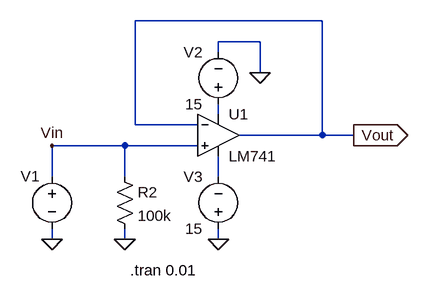
[diagram p0: schematic lab5_1.asc]
lab5_1.asc, the LTspice schematic file:
Version 4
SHEET 1 880 680
WIRE 336 0 48 0
WIRE 240 32 176 32
WIRE 176 48 176 32
WIRE 240 80 240 32
WIRE 176 144 176 128
WIRE 48 160 48 0
WIRE 144 160 48 160
WIRE 336 176 336 0
WIRE 336 176 208 176
WIRE 384 176 336 176
WIRE 32 192 -80 192
WIRE 144 192 32 192
WIRE -80 240 -80 192
WIRE 32 240 32 192
WIRE 176 240 176 208
WIRE -80 336 -80 320
WIRE 32 336 32 320
WIRE 176 336 176 320
FLAG -80 336 0
FLAG 240 80 0
FLAG 176 336 0
FLAG 384 176 Vout
IOPIN 384 176 Out
FLAG -80 192 Vin
FLAG 32 336 0
SYMBOL OpAmps\\LM741 176 112 R0
SYMATTR InstName U1
SYMBOL voltage -80 224 R0
WINDOW 3 24 96 Invisible 2
WINDOW 123 24 124 Left 2
WINDOW 39 0 0 Left 0
WINDOW 0 -48 15 Left 2
SYMATTR Value PULSE(-1 1 0 1e-6 1e-6 1e-3 2e-3)
SYMATTR InstName V1
SYMBOL voltage 176 144 R180
WINDOW 0 24 96 Left 2
WINDOW 3 24 16 Left 2
WINDOW 123 0 0 Left 0
WINDOW 39 0 0 Left 0
SYMATTR InstName V2
SYMATTR Value 15
SYMBOL voltage 176 336 R180
WINDOW 0 24 96 Left 2
WINDOW 3 24 16 Left 2
WINDOW 123 0 0 Left 0
WINDOW 39 0 0 Left 0
SYMATTR InstName V3
SYMATTR Value 15
SYMBOL res 16 224 R0
SYMATTR InstName R2
SYMATTR Value 100k
TEXT 40 384 Left 2 !.tran 0.01

The netlist it stands for:
* lab5_1.asc
XU1 Vin Vout N001 N002 Vout LM741  ; pins In+ In- V+ V- OUT
V1 Vin 0 PULSE(-1 1 0 1e-6 1e-6 1e-3 2e-3)
V2 N001 0 15
V3 0 N002 15
R2 Vin 0 100k
.tran 0.01
.lib LM741.lib
.backanno
.end